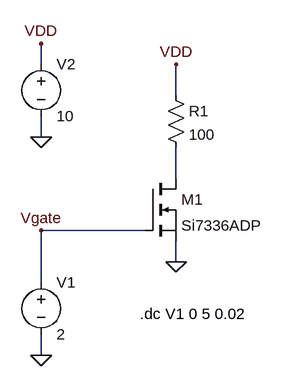
[diagram p0: schematic lab5_3.asc]
lab5_3.asc, the LTspice schematic file:
Version 4.1
SHEET 1 940 680
WIRE 0 -80 0 -112
WIRE 208 -32 208 -80
WIRE 0 32 0 0
WIRE 208 96 208 48
WIRE 160 176 0 176
WIRE 208 224 208 192
WIRE 0 256 0 176
WIRE 0 368 0 336
FLAG 208 224 0
FLAG 0 368 0
FLAG 0 -112 VDD
FLAG 0 32 0
FLAG 208 -80 VDD
FLAG 0 176 Vgate
SYMBOL nmos 160 96 R0
SYMATTR InstName M1
SYMATTR Value Si7336ADP
SYMBOL voltage 0 240 R0
WINDOW 123 0 0 Left 0
WINDOW 39 0 0 Left 0
SYMATTR InstName V1
SYMATTR Value 2
SYMBOL res 192 -48 R0
SYMATTR InstName R1
SYMATTR Value 100
SYMBOL voltage 0 -96 R0
WINDOW 123 0 0 Left 0
WINDOW 39 0 0 Left 0
SYMATTR InstName V2
SYMATTR Value 10
TEXT 152 304 Left 2 !.dc V1 0 5 0.02

The netlist it stands for:
* lab5_3.asc
M1 N001 Vgate 0 0 Si7336ADP
V1 Vgate 0 2
R1 VDD N001 100
V2 VDD 0 10
.model NMOS NMOS
.model PMOS PMOS
.lib standard.mos
.dc V1 0 5 0.02
.backanno
.end